# EasyEDA Pro project ProProject_单片机_2024-10-02.epro

# Schematic Schematic1
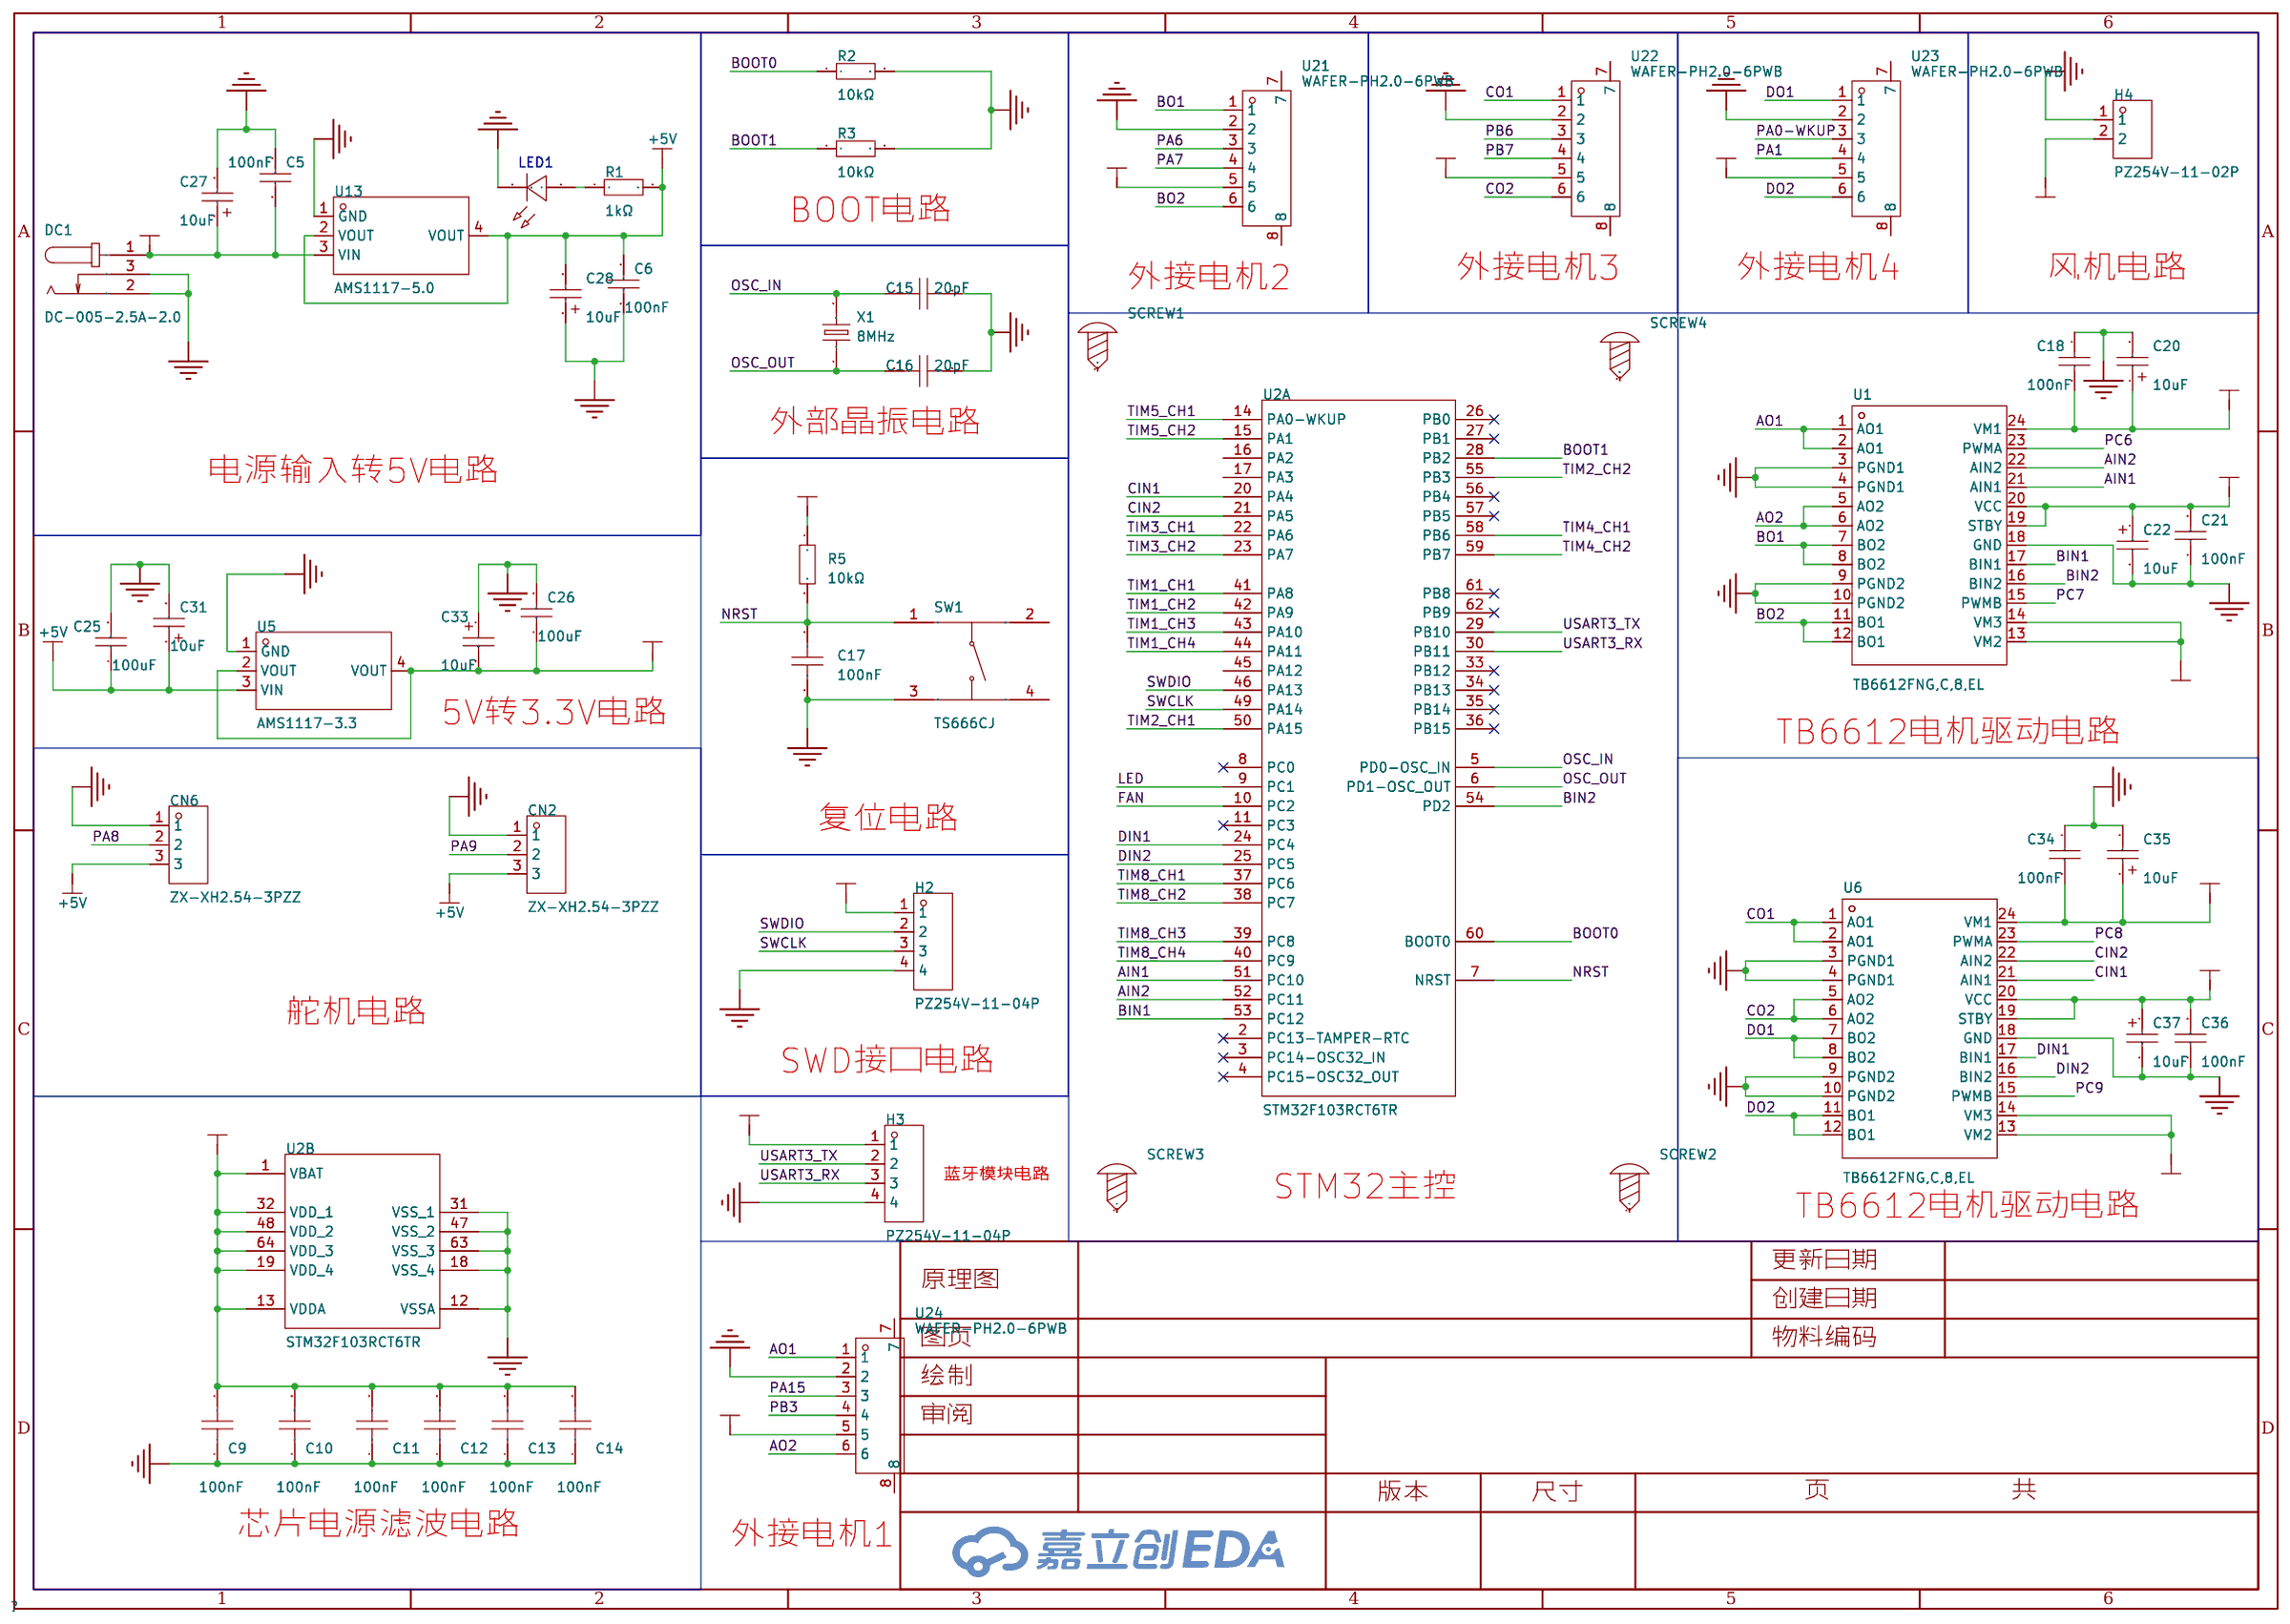
[diagram p0: schematic sheet]

## Parts
C5  100nF  [C0805]
C6  100nF  [C0805]
C9  100nF  [C0603]
C10  100nF  [C0603]
C11  100nF  [C0603]
C12  100nF  [C0603]
C13  100nF  [C0603]
C14  100nF  [C0603]
C15  20pF  [C0805]
C16  20pF  [C0805]
C17  100nF  [C0603]
C18  100nF  [C0805]
C20  10uF  [CAP-SMD_L3.2-W1.6-RD-C7171]
C21  100nF  [C0805]
C22  10uF  [CAP-SMD_L3.2-W1.6-RD-C7171]
C25  100uF  [C0805]
C26  100uF  [C0805]
C27  10uF  [CAP-SMD_L3.2-W1.6-RD-C7171]
C28  10uF  [CAP-SMD_L3.2-W1.6-RD-C7171]
C31  10uF  [CAP-SMD_L3.2-W1.6-RD-C7171]
C33  10uF  [CAP-SMD_L3.2-W1.6-RD-C7171]
C34  100nF  [C0805]
C35  10uF  [CAP-SMD_L3.2-W1.6-RD-C7171]
C36  100nF  [C0805]
C37  10uF  [CAP-SMD_L3.2-W1.6-RD-C7171]
CN2  ZX-XH2.54-3PZZ  [CONN-TH_3P-P2.54_2501S-3P]
CN6  ZX-XH2.54-3PZZ  [CONN-TH_3P-P2.54_2501S-3P]
DC1  DC-005-2.5A-2.0  [CONN-TH_DC-005-2.5A-2.0]
H2  PZ254V-11-04P  [HDR-TH_4P-P2.54-V-M]
H3  PZ254V-11-04P  [HDR-TH_4P-P2.54-V-M]
H4  PZ254V-11-02P  [HDR-TH_2P-P2.54-V-M]
LED1  -  [LED_0805]
R1  1kΩ  [R0805]
R2  10kΩ  [R0603]
R3  10kΩ  [R0603]
R5  10kΩ  [R0603]
SCREW1  -  [M3螺丝]
SCREW2  -  [M3螺丝]
SCREW3  -  [M3螺丝]
SCREW4  -  [M3螺丝]
SW1  TS666CJ  [SW-TH_4P-L6.0-W6.0-P4.50-LS6.5]
U1  TB6612FNG,C,8,EL  [SSOP-24_L8.3-W5.6-P0.65-LS7.6-BL]
U2  STM32F103RCT6TR  [LQFP-64_L10.0-W10.0-P0.50-LS12.0-BL]  (sections 1,2)
U5  AMS1117-3.3  [SOT-223-3_L6.5-W3.4-P2.30-LS7.0-BR]
U6  TB6612FNG,C,8,EL  [SSOP-24_L8.3-W5.6-P0.65-LS7.6-BL]
U13  AMS1117-5.0  [SOT-223_L6.5-W3.5-P2.30-LS7.0-BR]
U21  WAFER-PH2.0-6PWB  [CONN-SMD_6P-P2.00_XUNPU_WAFER-PH2.0-6PWB]
U22  WAFER-PH2.0-6PWB  [CONN-SMD_6P-P2.00_XUNPU_WAFER-PH2.0-6PWB]
U23  WAFER-PH2.0-6PWB  [CONN-SMD_6P-P2.00_XUNPU_WAFER-PH2.0-6PWB]
U24  WAFER-PH2.0-6PWB  [CONN-SMD_6P-P2.00_XUNPU_WAFER-PH2.0-6PWB]
X1  8MHz  [HC-49US_L11.5-W4.5-P4.88]

## Library data of the parts
C5 C6 C18 C21 C34 C36 = CC0805KRX7R9BB104: 容值:100nF;精度:±10%;额定电压:50V;材质(温度系数):X7R;; LCSC Part Name: 100nF ±10% 50V; Supplier Part: C49678; Manufacturer: YAGEO(国巨); Supplier Footprint: 0805; JLCPCB Part Class: 基础库; Datasheet: https://atta.szlcsc.com/upload/public/pdf/source/20180224/C181747_15194369449651363981.pdf; Supplier: LCSC; Tolerance: ±10%; Voltage Rated: 50V; Temperature Coefficient: X7R
C9-C14 C17 = CC0603KRX7R9BB104: 容值:100nF;精度:±10%;额定电压:50V;材质(温度系数):X7R;; LCSC Part Name: 100nF ±10% 50V; Supplier Part: C14663; Manufacturer: YAGEO(国巨); Supplier Footprint: 0603; JLCPCB Part Class: 基础库; Datasheet: https://atta.szlcsc.com/upload/public/pdf/source/20180910/C282072_33301C7F631E79921B82A8DAC6BCC5B3.pdf; Supplier: LCSC; Tolerance: ±10%; Voltage Rated: 50V; Temperature Coefficient: X7R
C15 C16 = 0805CG200J500NT: 容值:20pF;精度:±5%;额定电压:50V;材质(温度系数):C0G;; LCSC Part Name: 20pF ±5% 50V; Supplier Part: C94472; Manufacturer: FH(风华); Supplier Footprint: 0805; JLCPCB Part Class: 扩展库; Datasheet: https://atta.szlcsc.com/upload/public/pdf/source/20200305/C486355_26A10D38EF8C2A5C37091D0039909270.pdf; Supplier: LCSC; Tolerance: ±5%; Voltage Rated: 50V; Temperature Coefficient: C0G
C20 C22 C27 C28 C31 C33 C35 C37 = TAJA106K016RNJ: 容值:10uF;精度:±10%;额定电压:16V;等效串联电阻:3Ω@100kHz;; LCSC Part Name: 10uF ±10% 16V; Supplier Part: C7171; Manufacturer: Kyocera AVX; Supplier Footprint: CASE-A-3216; JLCPCB Part Class: 基础库; Datasheet: https://atta.szlcsc.com/upload/public/pdf/source/20160107/1457707750344.pdf; Supplier: LCSC; Tolerance: ±10%; Rated Voltage: 16V; Equivalent Series Resistance(ESR): 3Ω@100kHz; Operating Temperature: -55℃~+125℃
C25 C26 = GRM21BR60J107ME15L: 容值:100uF;精度:±20%;额定电压:6.3V;材质(温度系数):X5R;; LCSC Part Name: 100uF ±20% 6.3V; Supplier Part: C141660; Manufacturer: muRata(村田); Supplier Footprint: 0805; JLCPCB Part Class: Extended Part; Datasheet: https://atta.szlcsc.com/upload/public/pdf/source/20171113/C141660_15105613320671115822.pdf; Supplier: LCSC; Tolerance: ±20%; Voltage Rated: 6.3V; Temperature Coefficient: X5R
CN2 CN6 = ZX-XH2.54-3PZZ: 插针结构:1x3P;间距:2.54mm;安装方式:直插;参考系列:XH;总PIN数:3P;排数:1;每排PIN数:3;行距:-;额定电流:3A;触头材质:黄铜;触头镀层:锡;工作温度范围:-25℃~+85℃;; Supplier Part: C7429633; Manufacturer: Megastar(兆星); Supplier Footprint: 插件,P=2.54mm; JLCPCB Part Class: 扩展库; Datasheet: https://atta.szlcsc.com/upload/public/pdf/source/20230619/AE17037A2CFDBE8D9CBA775D61AD0A84.pdf; Supplier: LCSC; Pins Structure: 1x3P; Pitch: 2.54mm; Mounting Style: 直插; Reference Series: XH; Number of Pins: 3P; Number of Rows: 1; Number of PINs Per Row: 3; Current Rating (Max): 3A; Contact Material: 黄铜; Contact Plating: 锡; Operating Temperature Range: -25℃~+85℃
DC1 = DC-005-2.5A-2.0: 连接器类型:DC电源插座;安装方式:面板安装;触点内径:2mm;触点外径:6.2mm;额定电流:2.5A;额定电压:24V;触头材质:黄铜;工作温度范围:-20℃~+70℃;焊接温度(最大值):260℃;; LCSC Part Name: DC电源插座 内径:2mm 外径:6.2mm; Supplier Part: C319099; Manufacturer: XKB Connection(中国星坤); Supplier Footprint: 插件; JLCPCB Part Class: 扩展库; Datasheet: https://atta.szlcsc.com/upload/public/pdf/source/20230410/3C172F25A51FCA230ABE6D36425CBB3B.pdf; Supplier: LCSC; Connector Type: DC电源插座; Mounting Style: 面板安装; Inside Contact Diameter: 2mm; Outside Contact Diameter: 6.2mm; Current Rating (Max): 2.5A; Voltage Rating (Max): 24V; Contact Material: 黄铜; Operating Temperature Range: -20℃~+70℃; Soldering Temperature(Max): 260℃
H2 H3 = PZ254V-11-04P: 插针结构:1x4P;间距:2.54mm;行距:-;圆针/方针:方针;安装类型:直插;排数:单排;总PIN位数:4P;额定电流:3A;额定电压:250V;配合针长度:6mm;塑高:2.5mm;端接针长度:3mm;触头材质:-;工作温度范围:-40℃~+105℃;颜色:黑色;; LCSC Part Name: 间距:2.54mm 1x4P 直插 方针; Supplier Part: C2691448; Manufacturer: XFCN(兴飞); Supplier Footprint: 插件,P=2.54mm; JLCPCB Part Class: 扩展库; Datasheet: https://atta.szlcsc.com/upload/public/pdf/source/20200309/C492403_F9F19131791D08044AD4F84F8E751A34.pdf; Supplier: LCSC; Pin Structure: 1x4P; Pitch: 2.54mm; Circluar Pins/Square Pins: 方针; Mounting Type: 直插; Number of Rows: 单排; Number of Pins: 4P; Current Rating (Max): 3A; Voltage Rating (Max): 250V; Length of Mating Pin: 6mm; Insulation Height: 2.5mm; Length of End Connection Pin: 3mm; Operating Temperature Range: -40℃~+105℃; Color: 黑色
H4 = PZ254V-11-02P: 插针结构:1x2P;间距:2.54mm;行距:-;圆针/方针:方针;安装类型:直插;排数:单排;总PIN位数:2P;额定电流:-;额定电压:-;配合针长度:6mm;塑高:2.5mm;端接针长度:3mm;触头材质:黄铜;触头镀层:-;工作温度范围:-40℃~+105℃;颜色:黑色;; LCSC Part Name: 间距:2.54mm 1x2P 直插 方针; Supplier Part: C492401; Manufacturer: XFCN(兴飞); Supplier Footprint: 插件,P=2.54mm; JLCPCB Part Class: 扩展库; Datasheet: https://atta.szlcsc.com/upload/public/pdf/source/20200309/C492401_A812433581A9B211A7FFA413ADDFF0E5.pdf; Supplier: LCSC; Pin Structure: 1x2P; Pitch: 2.54mm; Circluar Pins/Square Pins: 方针; Mounting Type: 直插; Number of Rows: 单排; Number of Pins: 2P; Length of Mating Pin: 6mm; Insulation Height: 2.5mm; Length of End Connection Pin: 3mm; Contact Material: 黄铜; Operating Temperature Range: -40℃~+105℃; Color: 黑色
LED1 = LED_0805-B: Supplier Footprint: 0805
R1 = 0805W8F1001T5E: 电阻类型:厚膜电阻;阻值:1kΩ;精度:±1%;功率:125mW;最大工作电压:150V;温度系数:±100ppm/℃;; LCSC Part Name: 1kΩ ±1% 125mW 厚膜电阻; Supplier Part: C17513; Manufacturer: UNI-ROYAL(厚声); Supplier Footprint: 0805; JLCPCB Part Class: 基础库; Datasheet: https://atta.szlcsc.com/upload/public/pdf/source/20200306/C422600_1E6D84923E4A46A82E41ADD87F860B5C.pdf; Supplier: LCSC; Type: 厚膜电阻; Tolerance: ±1%; Power(Watts): 125mW; Overload Voltage (Max): 150V; Temperature Coefficient: ±100ppm/℃; Operating Temperature Range: -55℃~+155℃
R2 R3 R5 = 0603WAF1002T5E: 电阻类型:厚膜电阻;阻值:10kΩ;精度:±1%;功率:100mW;最大工作电压:75V;温度系数:±100ppm/℃;; LCSC Part Name: 厚膜电阻 10kΩ ±1% 100mW; Supplier Part: C25804; Manufacturer: UNI-ROYAL(厚声); Supplier Footprint: 0603; JLCPCB Part Class: 基础库; Datasheet: https://atta.szlcsc.com/upload/public/pdf/source/20200306/C422600_1E6D84923E4A46A82E41ADD87F860B5C.pdf; Supplier: LCSC; Type: 厚膜电阻; Tolerance: ±1%; Power(Watts): 100mW; Overload Voltage (Max): 75V; Temperature Coefficient: ±100ppm/℃; Operating Temperature Range: -55℃~+155℃
SCREW1-SCREW4 = M3螺丝: Supplier Footprint: 插件
SW1 = TS666CJ: 电路结构:单刀单掷;按钮形状:圆形按钮;作用力:250gf;安装方式:直插;开关长度:6mm;开关宽度:6mm;开关高度:6mm;带支架:不带;触点电流:50mA;额定电压(DC):12V;绝缘电阻:100MΩ;机械寿命:5万次;; LCSC Part Name: 6*6*6mm 直插 轻触开关; Supplier Part: C557621; Manufacturer: SHOU HAN(首韩); Supplier Footprint: 插件; JLCPCB Part Class: 扩展库; Datasheet: https://atta.szlcsc.com/upload/public/pdf/source/20200519/C557621_524FC94A9E7193E97F84899CC7F1F8B2.pdf; Supplier: LCSC; Circuit: 单刀单掷; Actuator Style: 圆形按钮; Operating Force: 250gf; Mounting Style: 直插; Switch Length: 6mm; Switch Width: 6mm; Switch Height: 6mm; Strike Gundam: 不带; Contact Current: 50mA; Voltage Rating (DC): 12V; Insulation Resistance: 100MΩ; Actuator/Cap Color: 黑色; Pin Style: PC引脚; Mechanical Life: 5万次; Operating Temperature: -20℃~+85℃
U1 U6 = TB6612FNG,C,8,EL: LCSC Part Name: 1A 有刷直流电机驱动芯片 5.5V; Supplier Part: C141517; Manufacturer: TOSHIBA(东芝); Supplier Footprint: SSOP-24; JLCPCB Part Class: 扩展库; Datasheet: https://atta.szlcsc.com/upload/public/pdf/source/20171128/C141517_15118625624231147036.pdf; Supplier: LCSC
U2 = STM32F103RCT6TR: CPU内核:ARM-M3;程序存储容量:256KB;RAM总容量:48KB;GPIO端口数量:51;工作电压范围:2V~3.6V;CPU最大主频:72MHz;程序存储器类型:FLASH;; LCSC Part Name: 主流增强型ARM Cortex-M3 MCU，具有256 KB Flash、72 MHz CPU、电机控制、USB和CAN; Supplier Part: C39704; Manufacturer: ST(意法半导体); Supplier Footprint: LQFP-64(10x10); JLCPCB Part Class: 扩展库; Datasheet: https://atta.szlcsc.com/upload/public/pdf/source/20151012/1457707442737.pdf; Supplier: LCSC; CPU Core: ARM-M3; Program Storage Size: 256KB; RAM Size: 48KB; GPIO Ports Number: 51; Operating Voltage Range: 2V~3.6V; CPU Maximum Speed: 72MHz; Program Memory Type: FLASH; Operating Temperature Range: -40℃~+85℃; ADC (Bit): 12bit; DAC (Bit): 12bit; Universal Serial Bus: 有; Peripheral/Function: 看门狗；DMA；看门狗；温度传感器; Watchdog: 有; Infrared Data Association: 有; Low-Voltage Detect: 有; Direct Memory Access: 有; Internal Oscillator: 有
U5 = AMS1117-3.3_C6186: 输出类型:固定;最大输入电压:-;输出电压:3.3V;最大输出电流:1A;电源纹波抑制比(PSRR):72dB@(120Hz);输出极性:正极;; LCSC Part Name: 输出3.3V 1A; Supplier Part: C6186; Manufacturer: AMS; Supplier Footprint: SOT-223; JLCPCB Part Class: 基础库; Datasheet: https://atta.szlcsc.com/upload/public/pdf/source/20180727/C6186_7A095716F0823C02F1997A905E26C086.pdf; Supplier: LCSC; Output Type: 固定; Output Voltage: 3.3V; MAX Output Current: 1A; Power Supply Rejection Ratio (PSRR): 72dB@(120Hz); Dropout Voltage: 1.3V@(800mA); Output Polarity: 正极; Number of Outputs: 1
U13 = AMS1117-5.0_C6187: 输出类型:固定;最大输入电压:12V;输出电压:5V;最大输出电流:1A;电源纹波抑制比(PSRR):68dB@(120Hz);输出极性:正极;; LCSC Part Name: 输入12V 输出5V 1A; Supplier Part: C6187; Manufacturer: AMS; Supplier Footprint: SOT-223; JLCPCB Part Class: 基础库; Datasheet: https://atta.szlcsc.com/upload/public/pdf/source/20230918/E4B716057EE82179D88E8A0894830D59.pdf; Supplier: LCSC; Output Type: 固定; Maximum Input Voltage: 12V; Output Voltage: 5V; MAX Output Current: 1A; Power Supply Rejection Ratio (PSRR): 68dB@(120Hz); Dropout Voltage: 1.3V@(1A); Output Polarity: 正极; Number of Outputs: 1
U21-U24 = WAFER-PH2.0-6PWB: 插针结构:1x6P;间距:2mm;安装方式:卧贴;总PIN数:6P;排数:1;每排PIN数:6;额定电流:2A;工作温度范围:-25℃~+85℃;; LCSC Part Name: 1x6P 间距:2mm 卧贴; Supplier Part: C3029444; Manufacturer: XUNPU(讯普); Supplier Footprint: SMD,P=2mm,卧贴; JLCPCB Part Class: 扩展库; Datasheet: https://atta.szlcsc.com/upload/public/pdf/source/20220527/83903C18429EFE4C9EEE8C529A248431.pdf; Supplier: LCSC; Pins Structure: 1x6P; Pitch: 2mm; Mounting Style: 卧贴; Number of Pins: 6P; Number of Rows: 1; Number of PINs Per Row: 6; Current Rating (Max): 2A; Operating Temperature Range: -25℃~+85℃
X1 = 49S-8.000-20-20-20/A: 晶振类型:直插晶振;频率:8MHz;常温频差:±20ppm;外接负载电容:20pF;频率稳定度(全温):±20ppm;; LCSC Part Name: 8MHz ±20ppm 20pF; Supplier Part: C240916; Manufacturer: LIMING(利明); Supplier Footprint: HC-49S; JLCPCB Part Class: 扩展库; Datasheet: https://atta.szlcsc.com/upload/public/pdf/source/20180930/C240954_D21D826943E58A9880472B1227802F84.pdf; Supplier: LCSC; Crystal Type: 直插晶振; Normal temperature Frequency Tolerance: ±20ppm; External load capacitor: 20pF; Frequency Stability(Full temperature range): ±20ppm; Operating Temperature: -20℃~+70℃

## Nets
+3.3V: C9.2 C10.2 C11.2 C12.2 C13.2 C14.2 C21.2 C22.1 C26.1 C33.2 C36.2 C37.1 H2.1 H3.1 R5.1 U1.19(STBY) U1.20(VCC) U2.1(VBAT) U2.13(VDDA) U2.19(VDD_4) U2.32(VDD_1) U2.48(VDD_2) U2.64(VDD_3) U5.2(VOUT) U5.4(VOUT) U6.19(STBY) U6.20(VCC) U21.5 U22.5 U23.5 U24.5
+5V: C6.1 C25.1 C28.2 C31.1 CN2.3 CN6.3 R1.2 U5.3(VIN) U13.2(VOUT) U13.4(VOUT)
+12V: C5.2 C18.2 C20.1 C27.1 C34.2 C35.1 DC1.1 H4.2 U1.13(VM2) U1.14(VM3) U1.24(VM1) U6.13(VM2) U6.14(VM3) U6.24(VM1) U13.3(VIN)
GND: C5.1 C6.2 C9.1 C10.1 C11.1 C12.1 C13.1 C14.1 C15.2 C16.2 C17.1 C18.1 C20.2 C21.1 C22.2 C25.2 C26.2 C27.2 C28.1 C31.2 C33.1 C34.1 C35.2 C36.1 C37.2 CN2.1 CN6.1 DC1.2 DC1.3 H2.4 H3.4 H4.1 LED1.1(C) R2.2 R3.2 SW1.3(C) U1.3(PGND1) U1.4(PGND1) U1.9(PGND2) U1.10(PGND2) U1.18(GND) U2.12(VSSA) U2.18(VSS_4) U2.31(VSS_1) U2.47(VSS_2) U2.63(VSS_3) U5.1(GND) U6.3(PGND1) U6.4(PGND1) U6.9(PGND2) U6.10(PGND2) U6.18(GND) U13.1(GND) U21.2 U22.2 U23.2 U24.2
AIN1: U1.21(AIN1) U2.51(PC10)
AIN2: U1.22(AIN2) U2.52(PC11)
AO1: U1.1(AO1) U1.2(AO1) U24.1
AO2: U1.5(AO2) U1.6(AO2) U24.6
BIN1: U1.17(BIN1) U2.53(PC12)
BIN2: U1.16(BIN2) U2.54(PD2)
BO1: U1.7(BO2) U1.8(BO2) U21.1
BO2: U1.11(BO1) U1.12(BO1) U21.6
BOOT0: R2.1 U2.60(BOOT0)
BOOT1: R3.1 U2.28(PB2)
CIN1: U2.20(PA4) U6.21(AIN1)
CIN2: U2.21(PA5) U6.22(AIN2)
CO1: U6.1(AO1) U6.2(AO1) U22.1
CO2: U6.5(AO2) U6.6(AO2) U22.6
DIN1: U2.24(PC4) U6.17(BIN1)
DIN2: U2.25(PC5) U6.16(BIN2)
DO1: U6.7(BO2) U6.8(BO2) U23.1
DO2: U6.11(BO1) U6.12(BO1) U23.6
FAN: U2.10(PC2)
LED: U2.9(PC1)
NRST: C17.2 R5.2 SW1.1(A) U2.7(NRST)
OSC_IN: C15.1 U2.5(PD0-OSC_IN) X1.2
OSC_OUT: C16.1 U2.6(PD1-OSC_OUT) X1.1
PA0-WKUP: U23.3
PA1: U23.4
PA6: U21.3
PA7: U21.4
PA8: CN6.2
PA9: CN2.2
PA15: U24.3
PB3: U24.4
PB6: U22.3
PB7: U22.4
PC6: U1.23(PWMA)
PC7: U1.15(PWMB)
PC8: U6.23(PWMA)
PC9: U6.15(PWMB)
SWCLK: H2.3 U2.49(PA14)
SWDIO: H2.2 U2.46(PA13)
TIM1_CH1: U2.41(PA8)
TIM1_CH2: U2.42(PA9)
TIM1_CH3: U2.43(PA10)
TIM1_CH4: U2.44(PA11)
TIM2_CH1: U2.50(PA15)
TIM2_CH2: U2.55(PB3)
TIM3_CH1: U2.22(PA6)
TIM3_CH2: U2.23(PA7)
TIM4_CH1: U2.58(PB6)
TIM4_CH2: U2.59(PB7)
TIM5_CH1: U2.14(PA0-WKUP)
TIM5_CH2: U2.15(PA1)
TIM8_CH1: U2.37(PC6)
TIM8_CH2: U2.38(PC7)
TIM8_CH3: U2.39(PC8)
TIM8_CH4: U2.40(PC9)
USART3_RX: H3.3 U2.30(PB11)
USART3_TX: H3.2 U2.29(PB10)
$1N15604: LED1.2(A) R1.1

Not connected (* = marked no-connect by the designer): SCREW1 1; SCREW2 1; SCREW3 1; SCREW4 1; SW1 2(B) 4(D); U2 2(PC13-TAMPER-RTC)* 3(PC14-OSC32_IN)* 4(PC15-OSC32_OUT)* 8(PC0)* 11(PC3)* 16(PA2) 17(PA3) 26(PB0)* 27(PB1)* 33(PB12)* 34(PB13)* 35(PB14)* 36(PB15)* 45(PA12) 56(PB4)* 57(PB5)* 61(PB8)* 62(PB9)*; U21 7 8; U22 7 8; U23 7 8; U24 7 8

## Notes on the sheet
- BOOT电路
- 外接电机2
- 外接电机3
- 外接电机4
- 风机电路
- 外部晶振电路
- 电源输入转5V电路
- 5V转3.3V电路
- TB6612电机驱动电路
- 复位电路
- 舵机电路
- SWD接口电路
- 蓝牙模块电路
- STM32主控
- TB6612电机驱动电路
- 芯片电源滤波电路
- 外接电机1

# Board PCB1
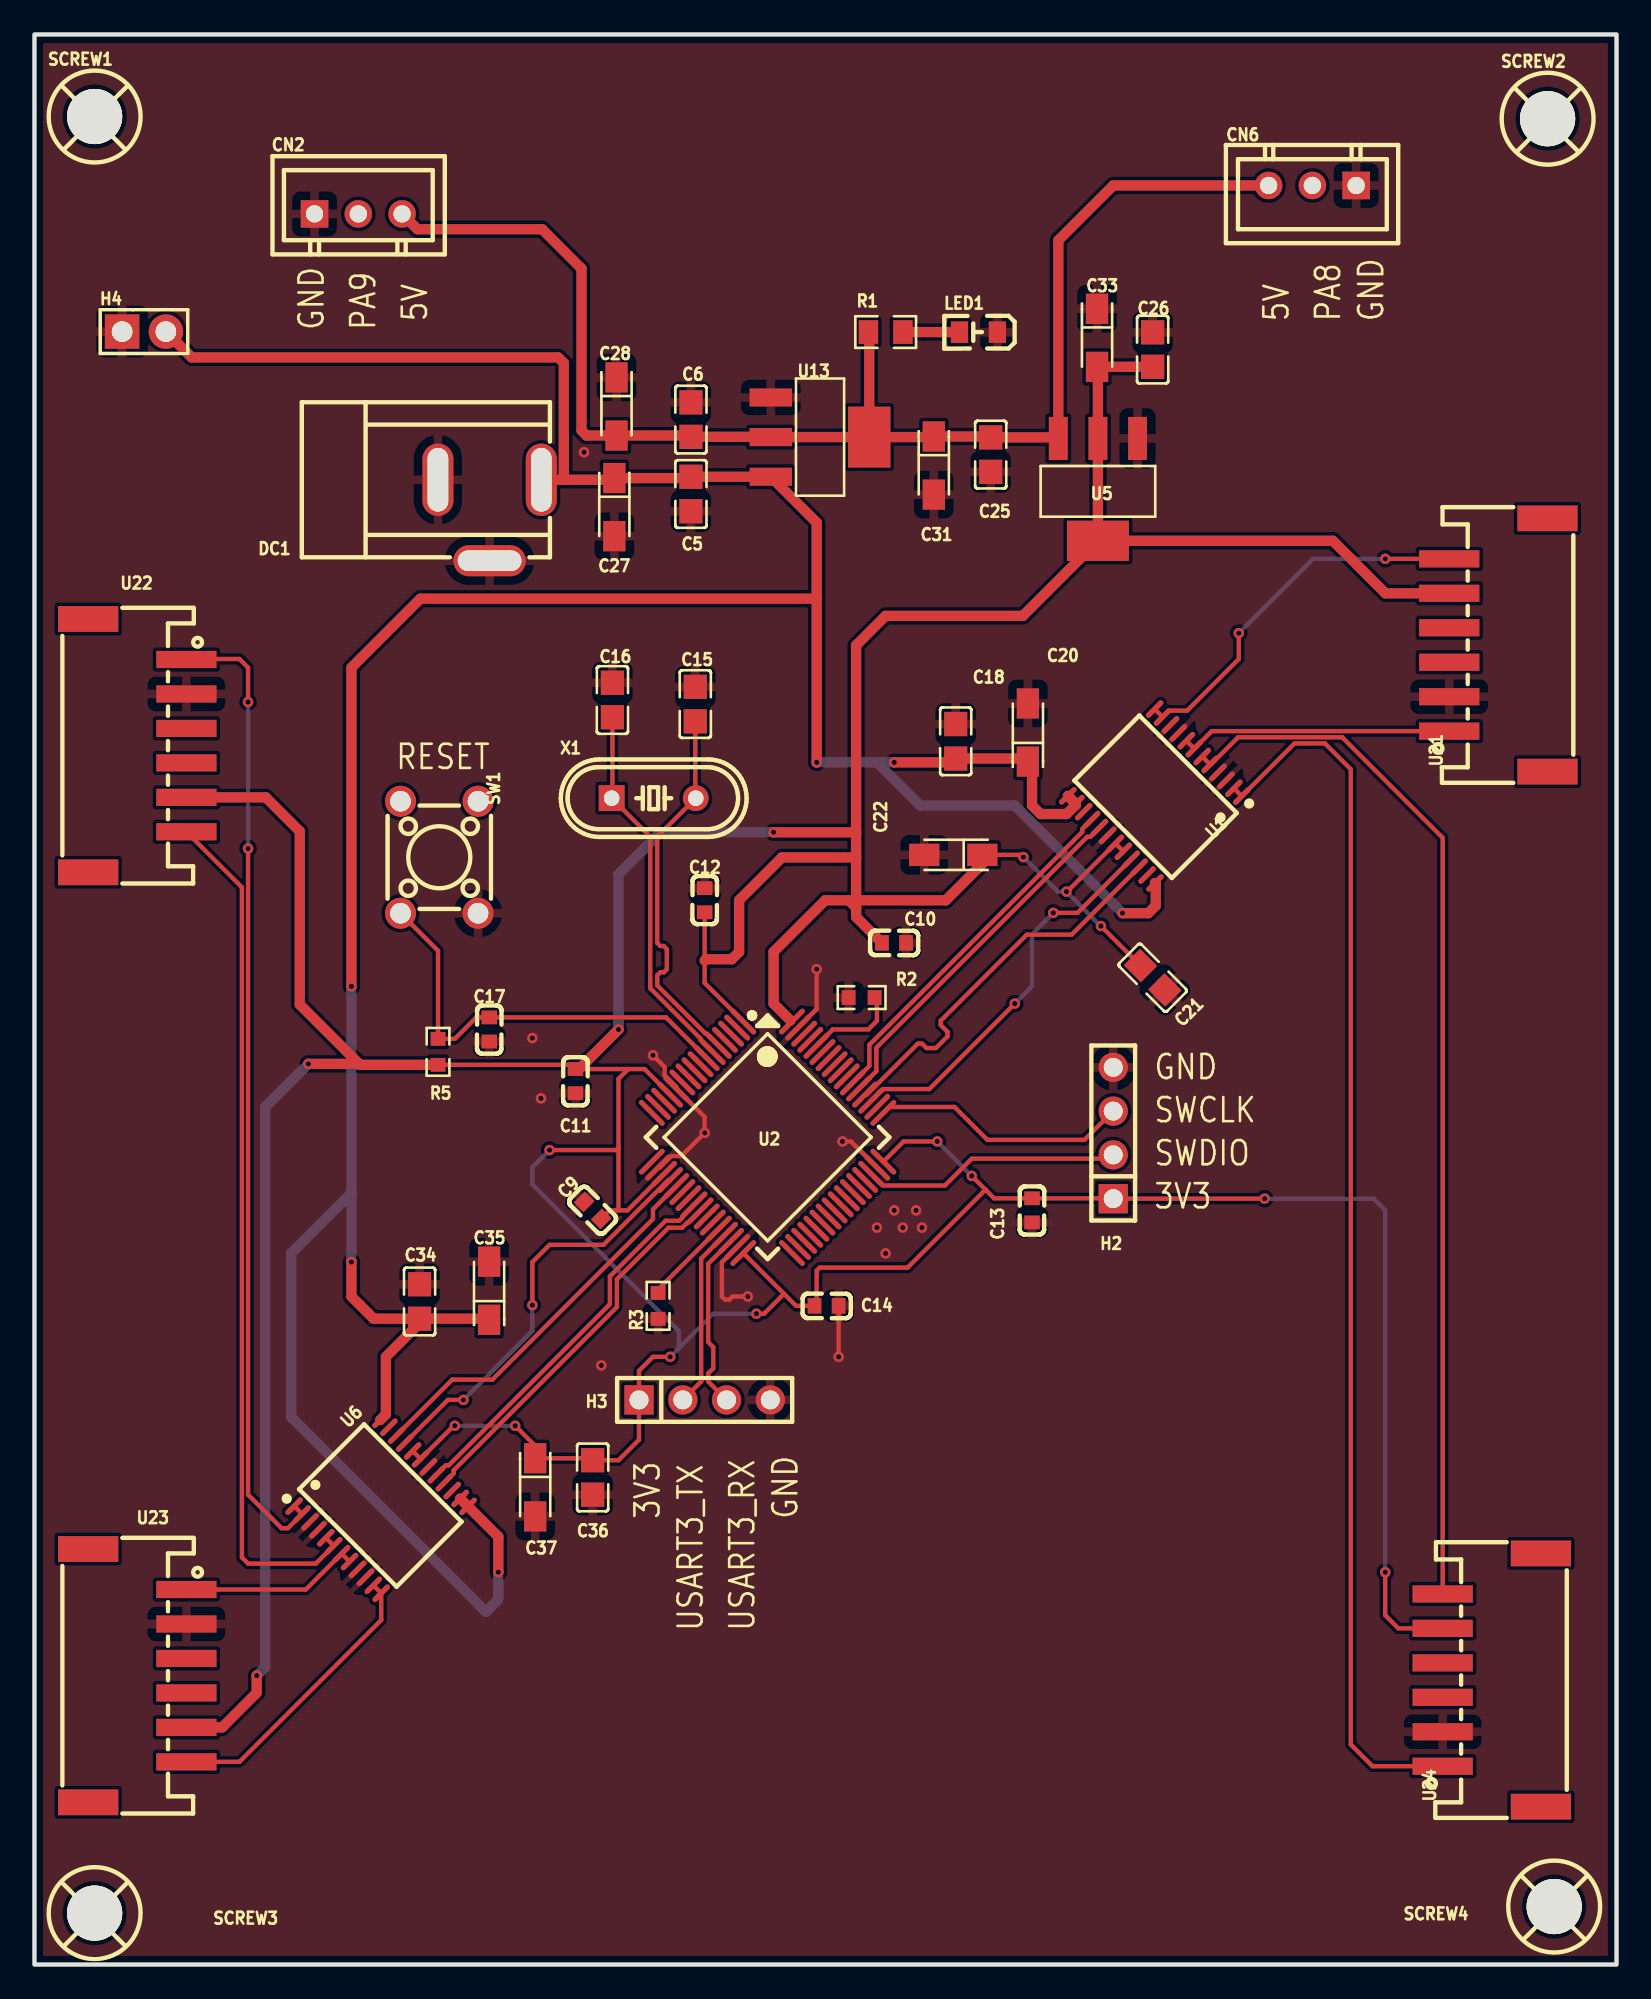
[diagram p1: board, top side]
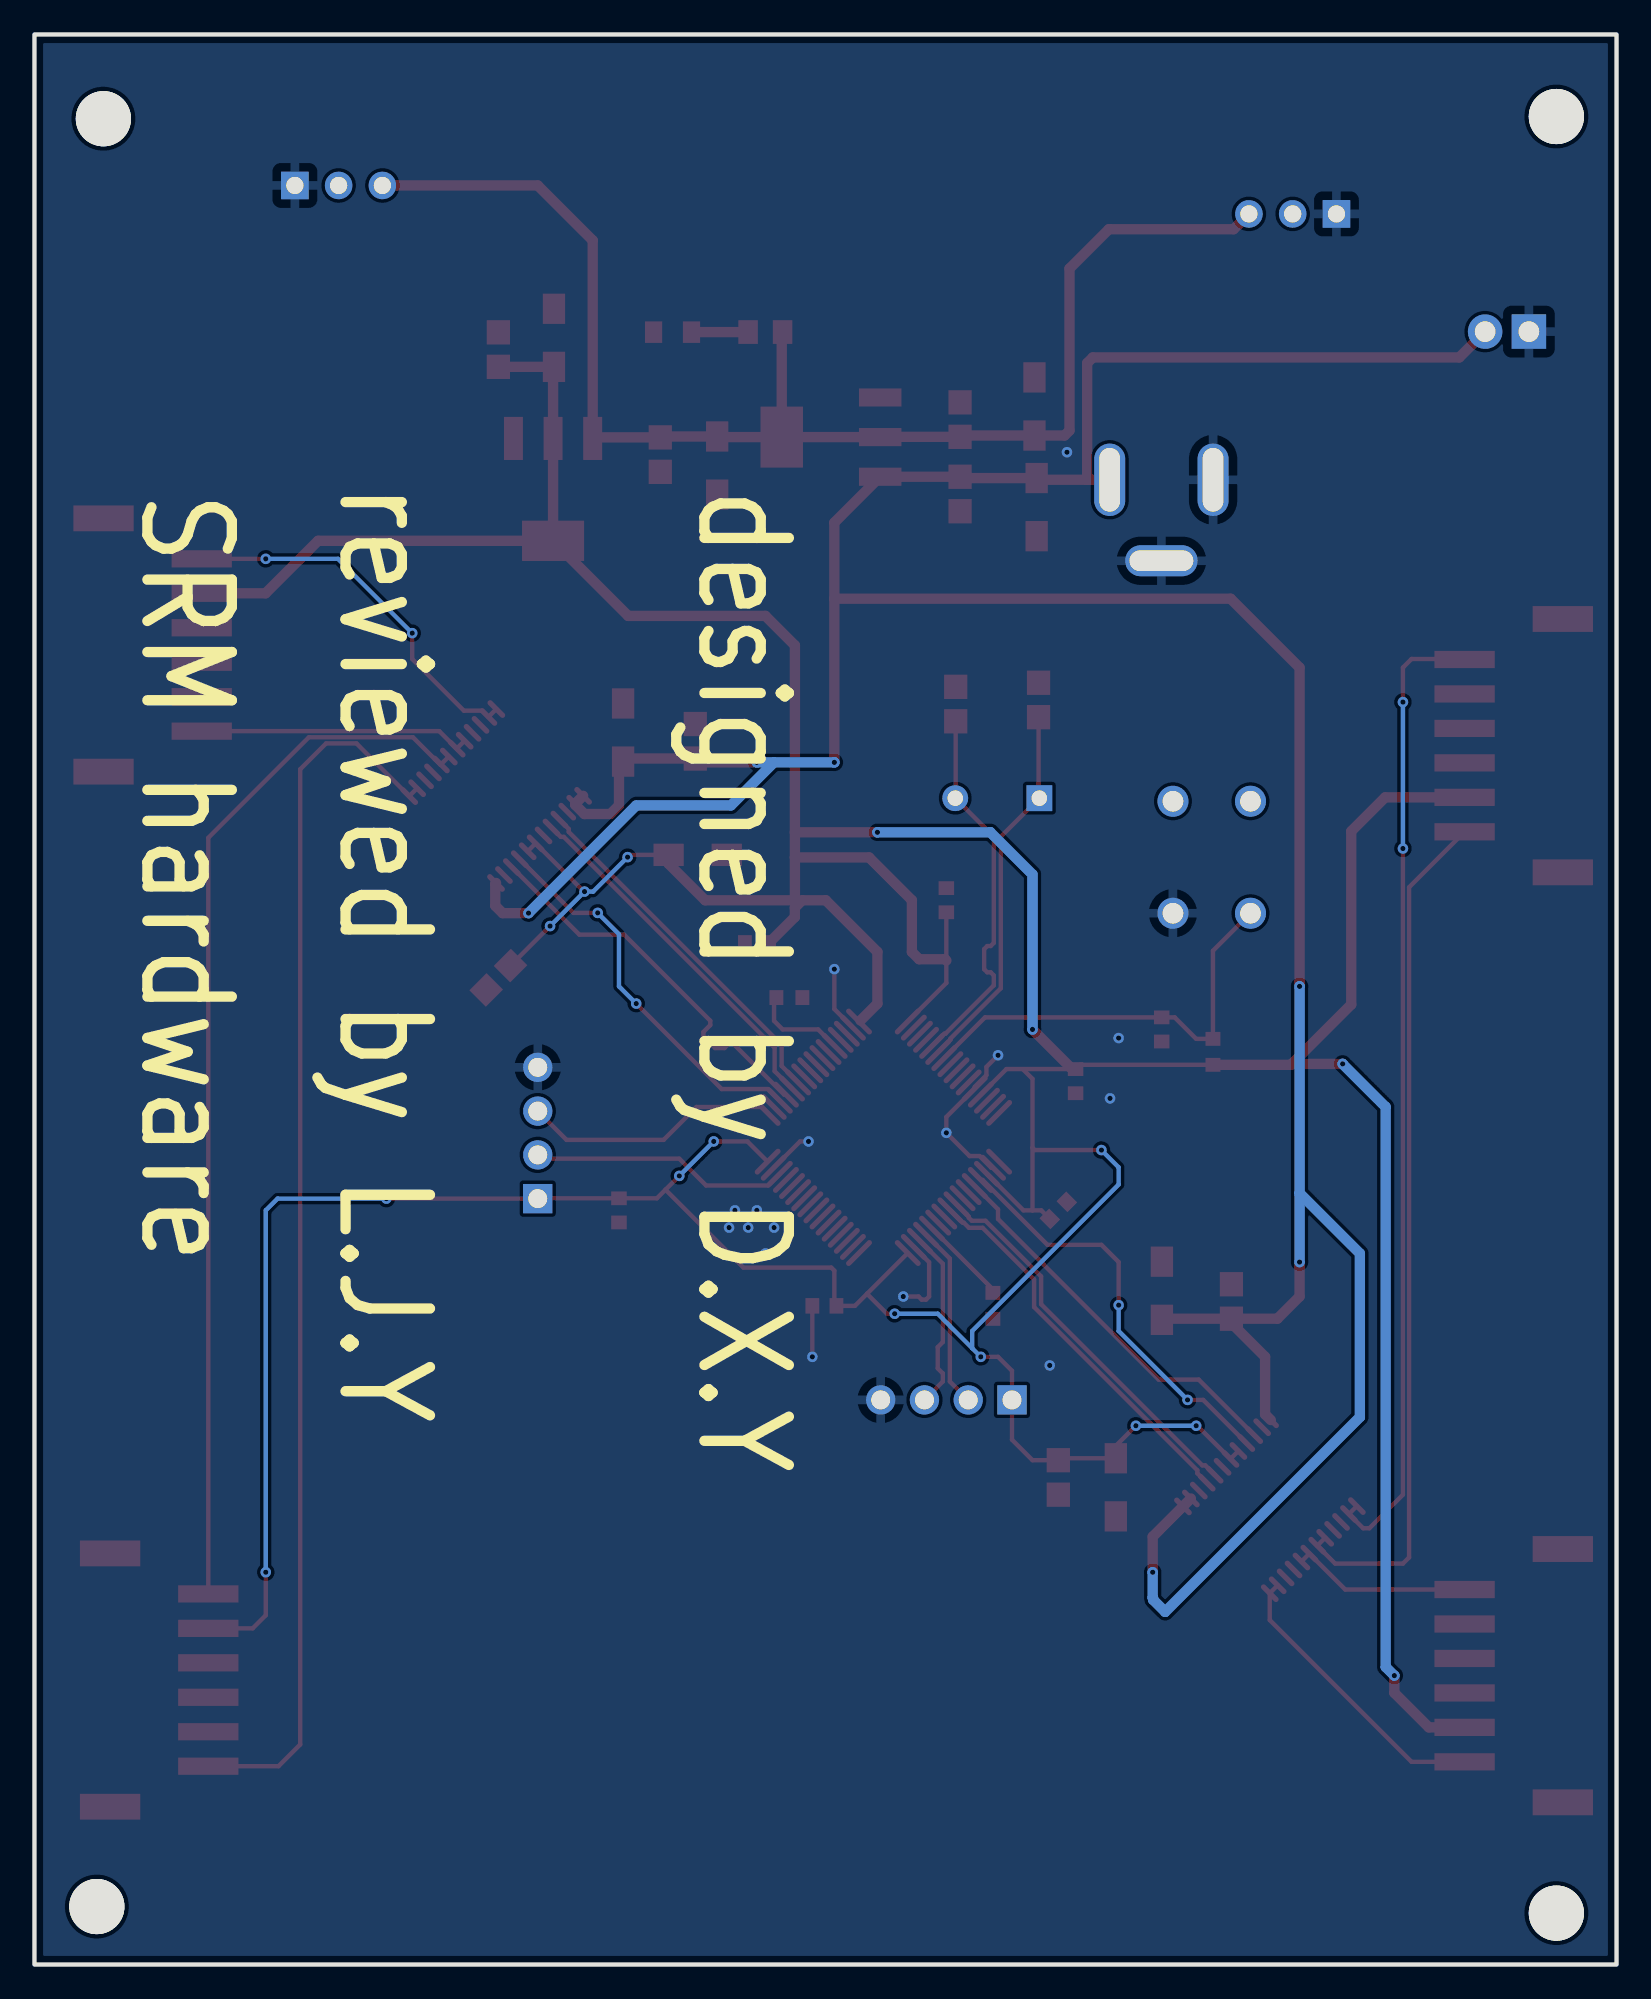
[diagram p2: board, bottom side, seen from below]

Outline 91.82 x 112.01 mm; copper layers: Top Layer, Bottom Layer. Coordinates in mm from the lower left corner of the outline.
Outline path: rectangle 0,112.01 91.82,0
Stack: Top Layer 0.035mm / Dielectric1 1.51mm FR4 er 4.5 / Bottom Layer 0.035mm

## Design rules (mm)
net OSC_IN: DP1
net OSC_OUT: DP1
net AIN2: DP4
net AIN1: DP4
net SWCLK: DP2
net SWDIO: DP2
net DIN1: DP5
net DIN2: DP5
net USART3_RX: DP6
net USART3_TX: DP6
net BIN2: DP3
net BIN1: DP3
template: JLCPCB Capability(Two Layers Board)
spacing copperThickness1oz (default): track to track 0.102, other pairs 0.152 to 0.3
spacing copperThickness2oz: track to track 0.203, other pairs 0.152 to 0.3
track width copperThickness1oz (default): min 0.127, default 0.254, max 2.54
track width copperThickness2oz: min 0.203, default 0.254, max 2.54
differential pair differentialPair (default): width min 0.127, default 0.254, max 2.54; gap min 0.152, default 0.152
via viaSize (default): diameter min 0.5, default 0.61, max 10; hole min 0.3, default 0.305, max 6.3

## Placement (name value [footprint] x y rotation side)
C5  100nF  [C0805]  38.1 85.34 90 top
C6  100nF  [C0805]  38.1 89.66 90 top
C9  100nF  [C0603]  32.4 43.77 315 top
C10  100nF  [C0603]  49.89 59.29 180 top
C11  100nF  [C0603]  31.4 51.27 90 top
C12  100nF  [C0603]  38.9 61.77 270 top
C13  100nF  [C0603]  57.9 43.77 90 top
C14  100nF  [C0603]  45.97 38.23 180 top
C15  20pF  [C0805]  38.35 73.15 90 top
C16  20pF  [C0805]  33.54 73.39 90 top
C17  100nF  [C0603]  26.4 54.27 90 top
C18  100nF  [C0805]  53.47 70.99 270 top
C20  10uF  [CAP-SMD_L3.2-W1.6-RD-C7171]  57.66 71.5 90 top
C21  100nF  [C0805]  64.9 57.27 135 top
C22  10uF  [CAP-SMD_L3.2-W1.6-RD-C7171]  53.33 64.4 180 top
C25  100uF  [C0805]  55.5 87.63 270 top
C26  100uF  [C0805]  64.9 93.73 90 top
C27  10uF  [CAP-SMD_L3.2-W1.6-RD-C7171]  33.66 84.58 270 top
C28  10uF  [CAP-SMD_L3.2-W1.6-RD-C7171]  33.78 90.42 270 top
C31  10uF  [CAP-SMD_L3.2-W1.6-RD-C7171]  52.2 87 270 top
C33  10uF  [CAP-SMD_L3.2-W1.6-RD-C7171]  61.67 94.41 270 top
C34  100nF  [C0805]  22.35 38.48 270 top
C35  10uF  [CAP-SMD_L3.2-W1.6-RD-C7171]  26.39 39.1 90 top
C36  100nF  [C0805]  32.4 28.27 90 top
C37  10uF  [CAP-SMD_L3.2-W1.6-RD-C7171]  29.06 27.7 270 top
CN2  ZX-XH2.54-3PZZ  [CONN-TH_3P-P2.54_2501S-3P]  18.8 101.6 0 top
CN6  ZX-XH2.54-3PZZ  [CONN-TH_3P-P2.54_2501S-3P]  74.17 103.25 180 top
DC1  DC-005-2.5A-2.0  [CONN-TH_DC-005-2.5A-2.0]  26.42 83.82 0 top
H2  PZ254V-11-04P  [HDR-TH_4P-P2.54-V-M]  62.61 48.26 90 top
H3  PZ254V-11-04P  [HDR-TH_4P-P2.54-V-M]  38.9 32.77 0 top
H4  PZ254V-11-02P  [HDR-TH_2P-P2.54-V-M]  6.36 94.77 0 top
LED1  -  [LED_0805]  54.74 94.74 180 top
R1  1kΩ  [R0805]  49.4 94.74 180 top
R2  10kΩ  [R0603]  48.01 56.12 180 top
R3  10kΩ  [R0603]  36.2 38.23 270 top
R5  10kΩ  [R0603]  23.42 52.97 90 top
SCREW1  -  [M3螺丝]  3.56 107.19 0 top
SCREW2  -  [M3螺丝]  87.88 107.06 0 top
SCREW3  -  [M3螺丝]  3.56 2.92 0 top
SCREW4  -  [M3螺丝]  88.27 3.3 0 top
SW1  TS666CJ  [SW-TH_4P-L6.0-W6.0-P4.50-LS6.5]  23.5 64.26 90 top
U1  TB6612FNG,C,8,EL  [SSOP-24_L8.3-W5.6-P0.65-LS7.6-BL]  65.02 67.82 135 top
U2  STM32F103RCT6TR  [LQFP-64_L10.0-W10.0-P0.50-LS12.0-BL]  42.55 48.01 225 top
U5  AMS1117-3.3  [SOT-223-3_L6.5-W3.4-P2.30-LS7.0-BR]  61.72 85.6 90 top
U6  TB6612FNG,C,8,EL  [SSOP-24_L8.3-W5.6-P0.65-LS7.6-BL]  20.12 26.6 315 top
U13  AMS1117-5.0  [SOT-223_L6.5-W3.5-P2.30-LS7.0-BR]  45.59 88.65 180 top
U21  WAFER-PH2.0-6PWB  [CONN-SMD_6P-P2.00_XUNPU_WAFER-PH2.0-6PWB]  84.96 76.58 90 top
U22  WAFER-PH2.0-6PWB  [CONN-SMD_6P-P2.00_XUNPU_WAFER-PH2.0-6PWB]  5.97 70.74 270 top
U23  WAFER-PH2.0-6PWB  [CONN-SMD_6P-P2.00_XUNPU_WAFER-PH2.0-6PWB]  5.97 16.76 270 top
U24  WAFER-PH2.0-6PWB  [CONN-SMD_6P-P2.00_XUNPU_WAFER-PH2.0-6PWB]  84.58 16.51 90 top
X1  8MHz  [HC-49US_L11.5-W4.5-P4.88]  35.94 67.69 0 top

## Footprints (pads in the part's own frame, mm; a bottom-side part is the same pattern mirrored in y, then rotated)
C0603
  rect 0.8x0.9 smd: 1(-0.7,0) 2(0.7,0)
C0805
  rect 1.41x1.35 smd: 1(-1,0) 2(1,0)
CAP-SMD_L3.2-W1.6-RD-C7171
  rect 1.758x1.296 smd: 1(-1.687,0) 2(1.687,0)
CONN-SMD_6P-P2.00_XUNPU_WAFER-PH2.0-6PWB
  rect 1x3.5 smd: 1(-5,2.85) 2(-3,2.85) 3(-1,2.85) 4(1,2.85) 5(3,2.85) 6(5,2.85)
  rect 1.5x3.5 smd: 7(-7.35,-2.85) 8(7.35,-2.85)
CONN-TH_3P-P2.54_2501S-3P
  rect 1.6x1.6 hole 1: 1(-2.54,0)
  round 1.6 hole 1: 2(0,0) 3(2.54,0)
CONN-TH_DC-005-2.5A-2.0
  oval 1.8x4.2 hole 1.2x3.7: 1(2.999,2.35) 2(-2.999,2.35)
  oval 4.2x1.8 hole 3.7x1.2: 3(0,-2.35)
HC-49US_L11.5-W4.5-P4.88
  rect 1.5x1.5 hole 0.9: 1(-2.44,0)
  round 1.5 hole 0.9: 2(2.44,0)
HDR-TH_2P-P2.54-V-M
  rect 2x2 hole 1.2: 1(-1.27,0)
  round 2 hole 1.2: 2(1.27,0)
HDR-TH_4P-P2.54-V-M
  rect 1.7x1.7 hole 1.1: 1(-3.81,0)
  round 1.7 hole 1.1: 2(-1.27,0) 3(1.27,0) 4(3.81,0)
LED_0805
  rect 1x1.25 smd: 1(-1.15,0.005) 2(1.05,0.005)
LQFP-64_L10.0-W10.0-P0.50-LS12.0-BL
  oval 0.3x2 smd: 1(-3.75,-5.75) 2(-3.25,-5.75) 3(-2.75,-5.75) 4(-2.25,-5.75) 5(-1.75,-5.75) 6(-1.25,-5.75) 7(-0.75,-5.75) 8(-0.25,-5.75) 9(0.25,-5.75) 10(0.75,-5.75) 11(1.25,-5.75) 12(1.75,-5.75) 13(2.25,-5.75) 14(2.75,-5.75) 15(3.25,-5.75) 16(3.75,-5.75) 33(3.75,5.75) 34(3.25,5.75) 35(2.75,5.75) 36(2.25,5.75) 37(1.75,5.75) 38(1.25,5.75) 39(0.75,5.75) 40(0.25,5.75) 41(-0.25,5.75) 42(-0.75,5.75) 43(-1.25,5.75) 44(-1.75,5.75) 45(-2.25,5.75) 46(-2.75,5.75) 47(-3.25,5.75) 48(-3.75,5.75)
  oval 2x0.3 smd: 17(5.75,-3.75) 18(5.75,-3.25) 19(5.75,-2.75) 20(5.75,-2.25) 21(5.75,-1.75) 22(5.75,-1.25) 23(5.75,-0.75) 24(5.75,-0.25) 25(5.75,0.25) 26(5.75,0.75) 27(5.75,1.25) 28(5.75,1.75) 29(5.75,2.25) 30(5.75,2.75) 31(5.75,3.25) 32(5.75,3.75) 49(-5.75,3.75) 50(-5.75,3.25) 51(-5.75,2.75) 52(-5.75,2.25) 53(-5.75,1.75) 54(-5.75,1.25) 55(-5.75,0.75) 56(-5.75,0.25) 57(-5.75,-0.25) 58(-5.75,-0.75) 59(-5.75,-1.25) 60(-5.75,-1.75) 61(-5.75,-2.25) 62(-5.75,-2.75) 63(-5.75,-3.25) 64(-5.75,-3.75)
M3螺丝
  round 3.2 hole 3.2: 1(-0.064,0.064)
R0603
  rect 0.806x0.864 smd: 1(-0.753,0) 2(0.753,0)
R0805
  rect 1.133x1.377 smd: 1(-1,0) 2(1,0)
SOT-223-3_L6.5-W3.4-P2.30-LS7.0-BR
  rect 2.5x1.1 smd: 1(2.97,-2.3) 2(2.97,0) 3(2.97,2.3)
  rect 2.34x3.6 smd: 4(-2.97,0)
SOT-223_L6.5-W3.5-P2.30-LS7.0-BR
  rect 2.465x1.05 smd: 1(2.857,-2.3) 2(2.857,0) 3(2.857,2.3)
  rect 2.465x3.54 smd: 4(-2.857,0)
SSOP-24_L8.3-W5.6-P0.65-LS7.6-BL
  oval 0.308x1.324 smd: 1(-3.575,-3.562) 2(-2.925,-3.562) 3(-2.275,-3.562) 4(-1.625,-3.562) 5(-0.975,-3.562) 6(-0.325,-3.562) 7(0.325,-3.562) 8(0.975,-3.562) 9(1.625,-3.562) 10(2.275,-3.562) 11(2.925,-3.562) 12(3.575,-3.562) 13(3.575,3.562) 14(2.925,3.562) 15(2.275,3.562) 16(1.625,3.562) 17(0.975,3.562) 18(0.325,3.562) 19(-0.325,3.562) 20(-0.975,3.562) 21(-1.625,3.562) 22(-2.275,3.562) 23(-2.925,3.562) 24(-3.575,3.562)
SW-TH_4P-L6.0-W6.0-P4.50-LS6.5
  round 1.8 hole 1.2: 1(-3.25,2.25) 2(3.25,2.25) 3(-3.25,-2.25) 4(3.25,-2.25)

## Nets
As in the schematic.

Pads without a net: SCREW1 1; SCREW2 1; SCREW3 1; SCREW4 1; SW1 2 4; U2 2 3 4 8 11 16 17 26 27 33 34 35 36 45 56 57 61 62; U21 7 8; U22 7 8; U23 7 8; U24 7 8

## Via types
v1: diameter 0.61, hole 0.305, Top Layer to Bottom Layer, 46 vias

## Routing (per net, layer and track width the routed paths; a pad name or vN(x,y) marks a point on that pad's centre or on a via; arc(x,y) is an arc through that point)
+3.3V: length 379.3
  Top Layer w0.254: 43.5,38.93 42.34,37.77 v1(41.9,37.77) ; 43.5,38.93 U2.32 ; 43.5,38.93 44.2,38.23 C14.2 45.4,38.35 45.4,40.27 45.58,40.45 50.68,40.45 55.2,44.97 ; U2.48 50.44,47.77 v1(52.4,47.77) ; 23.42,52.22 31.15,52.22 C11.2 ; v1(54.4,45.77) 55.2,44.97 ; 55.2,44.97 55.7,44.47 C13.2 62.59,44.47 H2.1 v1(71.4,44.45) ; 33.9,47.4 33.9,51.4 34.46,51.97 ; 33.9,47.4 33.77,47.27 v1(29.9,47.27) ; 33.9,47.4 33.9,43.77 ; U6.20 U6.19 24.33,31.27 v1(24.4,31.27) ; v1(57.4,64.27) 57.27,64.4 C22.1 ; U24.5 79.16,19.51 78.4,20.27 v1(78.4,22.77) ; U2.19 34.42,43.77 33.9,43.77 ; 32.89,43.27 33.39,43.77 33.9,43.77 ; 34.46,51.97 31.6,51.97 ; 34.46,51.97 35.41,51.97 U2.13 ; U2.1 38.9,56.97 C12.2 ; U1.20 U1.19 59.93,62.27 v1(59.9,62.27) ; v1(27.9,31.27) 29.06,30.1 C37.1 32.28,29.38 C36.2 33.9,29.27 35.09,30.46 H3.1 35.09,34.46 35.9,35.27 v1(36.9,35.27) ; v1(61.9,60.27) C21.2
  Top Layer w0.6: U23.5 10.89,13.76 12.9,15.77 v1(12.9,16.77) ; v1(33.9,54.27) 31.6,51.97 C11.2 ; U5.4 75.36,82.63 78.41,79.58 U21.5 ; U5.4 57.36,78.27 49.4,78.27 47.69,76.56 47.69,65.71 ; U5.4 61.72,92.67 C33.2 61.68,92.73 C26.1 ; U22.5 13.43,67.74 15.4,65.77 15.4,55.72 18.84,52.27 ; 47.69,65.71 47.69,64.25 ; 47.69,65.71 v1(42.9,65.71) ; 47.69,64.25 43.38,64.25 40.9,61.77 40.9,58.77 40.47,58.34 38.97,58.34 38.9,58.27 ; 47.69,64.25 47.69,61.76 52.89,61.76 55.01,63.89 C22.1 ; 43.88,54.79 42.9,55.77 42.9,58.77 45.89,61.76 47.26,61.76 47.69,61.34 47.69,60.79 C10.2 ; 18.84,52.27 v1(15.9,52.27) ; 18.84,52.27 18.9,52.22 23.42,52.22
  Bottom Layer w0.254: v1(52.4,47.77) v1(54.4,45.77) ; v1(61.9,60.27) v1(59.9,62.27) 59.4,62.27 v1(57.4,64.27) ; 37.4,35.77 39.4,37.77 v1(41.9,37.77) ; 37.4,35.77 v1(36.9,35.27) ; 37.4,35.77 37.4,36.77 28.9,45.27 28.9,46.27 v1(29.9,47.27) ; v1(71.4,44.45) 77.72,44.45 78.4,43.77 v1(78.4,22.77) ; v1(24.4,31.27) v1(27.9,31.27)
  Bottom Layer w0.6: v1(12.9,16.77) 13.4,17.27 13.4,49.77 v1(15.9,52.27) ; v1(33.9,54.27) 33.9,63.27 36.34,65.71 v1(42.9,65.71)
+5V: length 80.2
  Top Layer w0.6: CN6.3 62.61,103.25 59.42,100.06 59.42,88.57 59.36,88.63 C25.1 55.45,88.68 C31.1 52.16,88.65 U13.4 ; U13.4 U13.2 42.72,88.66 C6.1 38.02,88.74 C28.2 32.04,88.74 31.75,89.03 31.75,98.43 29.46,100.71 22.23,100.71 CN2.3 ; U13.4 48.45,94.69 R1.2
+12V: length 220.4
  Top Layer w0.6: v1(63.15,61.02) 64.65,61.02 65.08,61.45 65.08,62.73 U1.24 ; C34.2 26.32,37.48 C35.1 ; C34.2 22.35,37.22 20.4,35.27 20.4,31.93 20.07,31.6 ; C34.2 19.69,37.48 18.4,38.77 v1(18.4,40.77) ; DC1.1 30.72,86.17 ; 30.72,86.17 33.56,86.17 ; 30.72,86.17 30.72,92.94 30.4,93.27 9.13,93.27 H4.2 ; 45.4,79.27 v1(45.4,69.77) ; 45.4,79.27 45.4,83.68 U13.3 42.73,86.34 C5.2 38.02,86.27 C27.1 ; 45.4,79.27 22.39,79.27 18.4,75.27 v1(18.4,56.77) ; v1(26.92,22.77) 26.92,24.83 25.16,26.59 U6.14 ; v1(49.9,69.77) 53.24,69.77 C18.2 57.48,69.99 C20.1 57.9,69.58 57.9,67.27 58.4,66.77 59.9,66.77 60.44,67.31 U1.14 U1.13
  Bottom Layer w0.6: 18.4,44.77 14.9,41.27 14.9,31.77 26.2,20.47 26.9,21.17 26.9,21.27 26.92,21.29 v1(26.92,22.77) ; 18.4,44.77 v1(18.4,40.77) ; 18.4,44.77 v1(18.4,56.77) ; v1(63.15,61.02) 56.9,67.27 51.4,67.27 48.9,69.77 ; v1(45.4,69.77) 48.9,69.77 ; 48.9,69.77 v1(49.9,69.77)
GND: length 23.6
  Top Layer w0.254: v1(46.9,47.77) 47.39,47.77 U2.47 ; v1(45.4,57.77) 45.4,55.45 U2.63 ; U2.18 36.29,46.24 36.96,46.92 37.55,46.92 v1(38.9,48.27) 38.9,49.19 U2.12 37.25,50.94 36.57,51.62 36.57,52.09 v1(35.9,52.77) ; U2.31 39.9,40.76 39.9,38.77 40.08,38.59 40.33,38.59 40.51,38.77 v1(41.4,38.77) ; C14.1 v1(46.67,35.27)
  vias: v1(28.9,53.77) v1(29.4,50.27) v1(31.9,87.77) v1(32.9,34.77) v1(48.9,42.77) v1(49.4,41.27) v1(49.9,43.77) v1(50.4,42.77) v1(51.17,43.77) v1(51.51,42.77)
AIN1: length 22.7
  Top Layer w0.254: 63.65,64.15 60.54,61.03 v1(59.13,61.03) ; v1(56.9,55.77) 51.94,50.81 49.24,50.81 U2.51
  Bottom Layer w0.254: v1(59.13,61.03) 57.9,59.8 57.9,56.77 v1(56.9,55.77)
AIN2: length 22.7
  Top Layer w0.254: U1.22 60.19,59.77 57.59,59.77 52.6,54.78 52.6,54.52 53,54.12 53,53.87 52.32,53.19 51.77,53.19 51.52,53.44 51.27,53.44 48.31,50.49 U2.52
AO1: length 71.3
  Top Layer w0.254: U24.1 77.66,11.51 76.4,12.77 76.4,69.37 74.9,70.87 73.13,70.87 U1.1 U1.2
AO2: length 61.1
  Top Layer w0.254: U24.6 81.73,65.39 75.9,71.23 69.85,71.23 68.28,69.65 U1.5 U1.6
BIN1: length 21
  Top Layer w0.254: U1.17 61.27,65.45 61.1,65.45 48.86,53.21 48.86,51.85 47.85,50.84
BIN2: length 21
  Top Layer w0.254: U1.16 60.81,65.91 60.81,65.73 48.46,53.38 48.46,52.15 U2.54
BO1: length 15.9
  Top Layer w0.254: U1.8 U1.7 68.33,71.58 U21.1
BO2: length 21.4
  Top Layer w0.254: v1(69.9,77.27) 69.9,75.77 66.9,72.77 65.9,72.77 ; U21.6 v1(78.4,81.58) ; U1.12 U1.11
  Bottom Layer w0.254: v1(69.9,77.27) 74.21,81.58 v1(78.4,81.58)
BOOT0: length 5.5
  Top Layer w0.254: R2.1 48.9,55.98 48.9,54.77 48.4,54.27 46.33,54.27 U2.60
BOOT1: length 5.2
  Top Layer w0.254: U2.28 36.2,39.18 R3.1
CIN1: length 24.1
  Top Layer w0.254: U6.21 23.99,32.77 v1(24.9,32.77) ; U2.20 36.79,45.54 33.03,41.77 29.9,41.77 28.9,40.77 v1(28.9,38.27)
  Bottom Layer w0.254: v1(28.9,38.27) 28.9,36.77 v1(24.9,32.77)
CIN2: length 22.5
  Top Layer w0.254: U6.22 24.25,33.95 26.58,33.95 35.9,43.27 35.9,43.83 U2.21
CO1: length 56.7
  Top Layer w0.254: v1(12.4,73.27) 12.4,75.27 11.9,75.77 8.85,75.77 U22.1 ; v1(12.4,64.77) 12.4,27.27 14.35,25.32 14.7,25.32 U6.2 U6.1
  Bottom Layer w0.254: v1(12.4,64.77) v1(12.4,73.27)
CO2: length 50
  Top Layer w0.254: U22.6 12.04,62.52 12.04,23.62 12.4,23.27 16.33,23.27 U6.6 16.91,24.77
DIN1: length 22.5
  Top Layer w0.254: U6.17 23.87,28.97 24.04,28.97 33.4,38.33 33.4,39.94 36.63,43.17 37.42,43.17 37.6,43.34 37.6,43.41 U2.24
DIN2: length 22.5
  Top Layer w0.254: U6.16 24.33,28.51 24.33,28.68 33.8,38.16 33.8,39.77 36.79,42.76 37.59,42.76 37.89,43.06 37.95,43.06 38.66,43.77
DO1: length 10.5
  Top Layer w0.254: U6.8 U6.7 15.74,21.76 U23.1
DO2: length 16.9
  Top Layer w0.254: U23.6 11.9,11.76 20.13,19.99 U6.12 U6.11
NRST: length 25.3
  Top Layer w0.254: SW1.1 23.42,58.83 R5.2 24.4,53.72 25.64,54.97 C17.2 36.65,54.97 U2.7
OSC_IN: length 22
  Top Layer w0.254: U2.5 39.01,54.02 38.95,54.02 36.14,56.83 36.14,57.41 36.32,57.59 36.52,57.59 36.7,57.77 36.7,58.93 36.52,59.11 36.32,59.11 36.14,59.29 36.14,65.45 X1.2 38.35,67.72 C15.1
OSC_OUT: length 21.9
  Top Layer w0.254: U2.6 38.66,53.67 38.66,53.74 35.74,56.66 35.74,65.45 X1.1 33.54,67.73 C16.1
SWCLK: length 15
  Top Layer w0.254: H2.3 60.94,47.86 55.31,47.86 53.4,49.77 49.61,49.77 U2.49
SWDIO: length 15.1
  Top Layer w0.254: U2.46 49.24,45.21 52.84,45.21 54.4,46.77 62.39,46.77 H2.2
USART3_RX: length 10.5
  Top Layer w0.254: H3.3 39.1,33.84 39.1,34.31 39.4,34.6 39.4,35.83 39.1,36.13 39.1,40.67 U2.30
USART3_TX: length 10.6
  Top Layer w0.254: U2.29 38.69,40.97 38.69,33.84 H3.2
$1N15604: length 3.3
  Top Layer w0.6: R1.1 53.68,94.74 LED1.2

## Copper pours and planes (outline as drawn; the poured copper is in the pictures)
GND on Top Layer: 0,112.01 91.82,112.01 91.82,0.3 0,0.3
GND on Top Layer: -7.6,134.27 99.4,134.27 99.4,-23.23 -7.6,-23.23
GND on Bottom Layer: 0,112.01 91.82,112.01 91.82,0 0,0
GND on Bottom Layer: -21.6,118.27 116.9,118.27 116.9,-7.73 -21.6,-7.73

## Text on the board
Bottom Silkscreen Layer: designed by D.X.Y | reviewed by L.J.Y | SRM hardware
Top Silkscreen Layer: RESET | GND | SWCLK | SWDIO | 3V3 | PA9 | 5V | USART3_TX | USART3_RX | PA8
